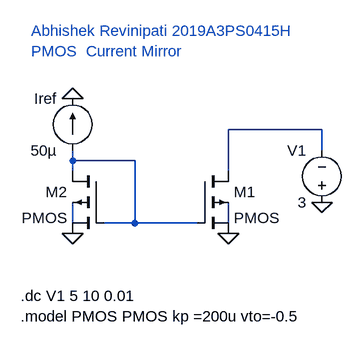
[diagram p0: schematic 2019A3PS0415H_PMOS_CM.asc]
2019A3PS0415H_PMOS_CM.asc, the LTspice schematic file:
Version 4
SHEET 1 880 680
WIRE 432 -192 288 -192
WIRE 432 -160 432 -192
WIRE 48 -144 48 -160
WIRE 144 -144 48 -144
WIRE 48 -128 48 -144
WIRE 288 -128 288 -192
WIRE 48 -48 48 -80
WIRE 144 -48 144 -144
WIRE 144 -48 96 -48
WIRE 240 -48 144 -48
WIRE 288 -48 288 -80
FLAG 48 -240 0
FLAG 432 -80 0
FLAG 48 -32 0
FLAG 288 -32 0
SYMBOL current 48 -160 R180
WINDOW 0 24 80 Left 2
WINDOW 3 24 0 Left 2
WINDOW 123 0 0 Left 0
WINDOW 39 0 0 Left 0
SYMATTR InstName Iref
SYMATTR Value 50µ
SYMBOL voltage 432 -64 R180
WINDOW 0 24 96 Left 2
WINDOW 3 24 16 Left 2
WINDOW 123 0 0 Left 0
WINDOW 39 0 0 Left 0
SYMATTR InstName V1
SYMATTR Value 3
SYMBOL pmos4 240 -128 R0
SYMATTR InstName M1
SYMATTR Value2 l=15u w=75u
SYMBOL pmos4 96 -128 M0
SYMATTR InstName M2
SYMATTR Value2 l=15u w=75u
TEXT -32 64 Left 2 !.dc V1 5 10 0.01
TEXT -32 96 Left 2 !.model PMOS PMOS kp =200u vto=-0.5
TEXT -16 -344 Left 2 ;Abhishek Revinipati 2019A3PS0415H\nPMOS  Current Mirror

The netlist it stands for:
* 2019A3PS0415H_PMOS_CM.asc
Iref N002 0 50µ
V1 0 N001 3
M1 N001 N002 0 N004 PMOS l=15u w=75u
M2 N002 N002 0 N003 PMOS l=15u w=75u
.model NMOS NMOS
.model PMOS PMOS
.lib standard.mos
.dc V1 5 10 0.01
.model PMOS PMOS kp =200u vto=-0.5
* Abhishek Revinipati 2019A3PS0415H
* PMOS  Current Mirror
.backanno
.end